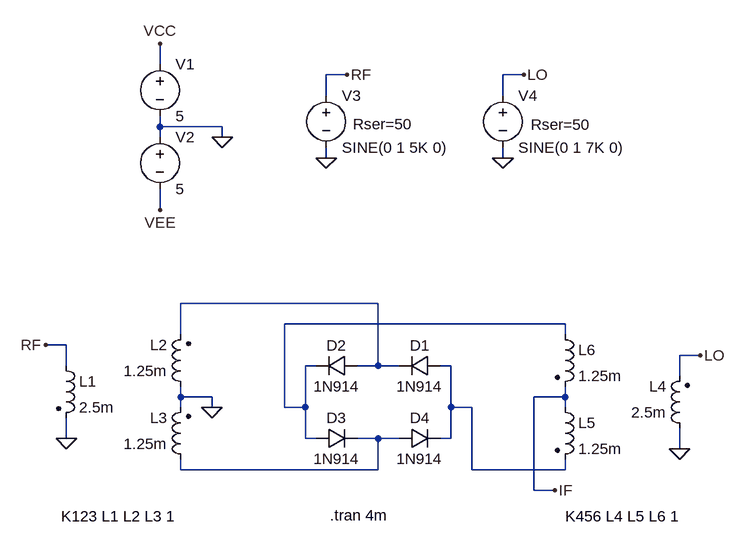
[diagram p0: schematic diode-mixer.asc]
diode-mixer.asc, the LTspice schematic file:
Version 4
SHEET 1 1360 680
WIRE 480 -304 480 -336
WIRE 768 -288 736 -288
WIRE 1040 -288 1008 -288
WIRE 736 -256 736 -288
WIRE 1008 -256 1008 -288
WIRE 480 -208 480 -224
WIRE 576 -208 480 -208
WIRE 480 -192 480 -208
WIRE 576 -192 576 -208
WIRE 736 -160 736 -176
WIRE 1008 -160 1008 -176
WIRE 480 -80 480 -112
WIRE 816 64 512 64
WIRE 1104 96 672 96
WIRE 512 112 512 64
WIRE 1104 112 1104 96
WIRE 336 128 304 128
WIRE 1312 144 1280 144
WIRE 336 160 336 128
WIRE 720 160 704 160
WIRE 816 160 816 64
WIRE 816 160 784 160
WIRE 848 160 816 160
WIRE 928 160 912 160
WIRE 1280 176 1280 144
WIRE 512 208 512 192
WIRE 560 208 512 208
WIRE 1104 208 1104 192
WIRE 1104 208 1056 208
WIRE 512 224 512 208
WIRE 560 224 560 208
WIRE 672 224 672 96
WIRE 704 224 704 160
WIRE 704 224 672 224
WIRE 928 224 928 160
WIRE 960 224 928 224
WIRE 1104 224 1104 208
WIRE 336 272 336 240
WIRE 704 272 704 224
WIRE 720 272 704 272
WIRE 816 272 784 272
WIRE 848 272 816 272
WIRE 928 272 928 224
WIRE 928 272 912 272
WIRE 1280 288 1280 256
WIRE 512 320 512 304
WIRE 816 320 816 272
WIRE 816 320 512 320
WIRE 960 320 960 224
WIRE 1104 320 1104 304
WIRE 1104 320 960 320
WIRE 1056 352 1056 208
WIRE 1088 352 1056 352
FLAG 1008 -160 0
FLAG 736 -160 0
FLAG 576 -192 0
FLAG 480 -336 VCC
FLAG 480 -80 VEE
FLAG 768 -288 RF
FLAG 1040 -288 LO
FLAG 1280 288 0
FLAG 336 272 0
FLAG 560 224 0
FLAG 1088 352 IF
FLAG 1312 144 LO
FLAG 304 128 RF
SYMBOL voltage 480 -320 R0
SYMATTR InstName V1
SYMATTR Value 5
SYMBOL voltage 480 -208 R0
SYMATTR InstName V2
SYMATTR Value 5
SYMBOL voltage 736 -272 R0
WINDOW 123 0 0 Left 0
WINDOW 39 41 60 Left 2
SYMATTR InstName V3
SYMATTR Value SINE(0 1 5K 0)
SYMATTR SpiceLine Rser=50
SYMBOL voltage 1008 -272 R0
WINDOW 123 0 0 Left 0
WINDOW 39 43 61 Left 2
SYMATTR InstName V4
SYMATTR Value SINE(0 1 7K 0)
SYMATTR SpiceLine Rser=50
SYMBOL diode 912 144 R90
WINDOW 0 0 32 VBottom 2
WINDOW 3 32 32 VTop 2
SYMATTR InstName D1
SYMATTR Value 1N914
SYMBOL ind2 320 144 R0
SYMATTR InstName L1
SYMATTR Value 2.5m
SYMATTR Type ind
SYMBOL diode 784 144 R90
WINDOW 0 0 32 VBottom 2
WINDOW 3 32 32 VTop 2
SYMATTR InstName D2
SYMATTR Value 1N914
SYMBOL diode 720 288 R270
WINDOW 0 32 32 VTop 2
WINDOW 3 0 32 VBottom 2
SYMATTR InstName D3
SYMATTR Value 1N914
SYMBOL diode 848 288 R270
WINDOW 0 32 32 VTop 2
WINDOW 3 0 32 VBottom 2
SYMATTR InstName D4
SYMATTR Value 1N914
SYMBOL ind2 528 208 R180
WINDOW 0 36 80 Left 2
WINDOW 3 36 40 Left 2
SYMATTR InstName L2
SYMATTR Value 1.25m
SYMATTR Type ind
SYMBOL ind2 528 320 R180
WINDOW 0 36 80 Left 2
WINDOW 3 36 40 Left 2
SYMATTR InstName L3
SYMATTR Value 1.25m
SYMATTR Type ind
SYMBOL ind2 1296 272 R180
WINDOW 0 36 80 Left 2
WINDOW 3 36 40 Left 2
SYMATTR InstName L4
SYMATTR Value 2.5m
SYMATTR Type ind
SYMBOL ind2 1088 208 R0
SYMATTR InstName L5
SYMATTR Value 1.25m
SYMATTR Type ind
SYMBOL ind2 1088 96 R0
SYMATTR InstName L6
SYMATTR Value 1.25m
SYMATTR Type ind
TEXT 328 392 Left 2 !K123 L1 L2 L3 1
TEXT 1104 392 Left 2 !K456 L4 L5 L6 1
TEXT 742 390 Left 2 !.tran 4m

The netlist it stands for:
* diode-mixer.asc
V1 VCC 0 5
V2 0 VEE 5
V3 RF 0 SINE(0 1 5K 0) Rser=50
V4 LO 0 SINE(0 1 7K 0) Rser=50
D1 N003 N001 1N914
L1 RF 0 2.5m
D2 N001 N002 1N914
D3 N002 N004 1N914
D4 N004 N003 1N914
L2 0 N001 1.25m
L3 N004 0 1.25m
L4 0 LO 2.5m
L5 IF N003 1.25m
L6 N002 IF 1.25m
.model D D
.lib standard.dio
K123 L1 L2 L3 1
K456 L4 L5 L6 1
.tran 4m
.backanno
.end